# EAGLE design Z80_Control (EAGLE 5.11)
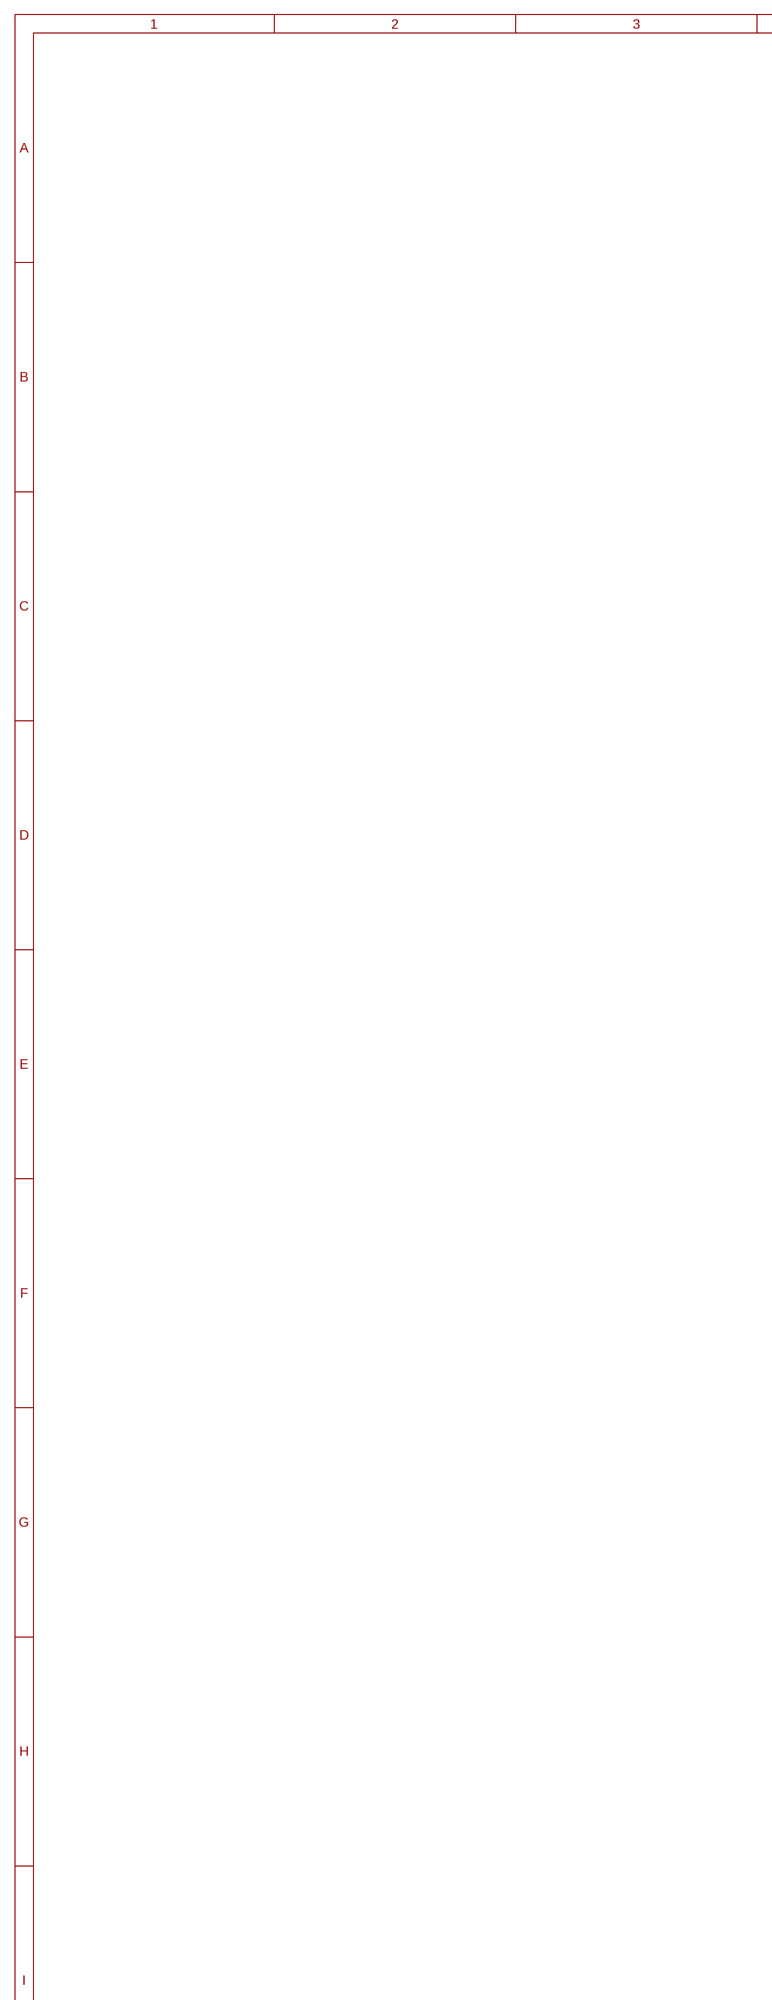
[diagram p0: schematic, sheet 1, part 1 of 2]
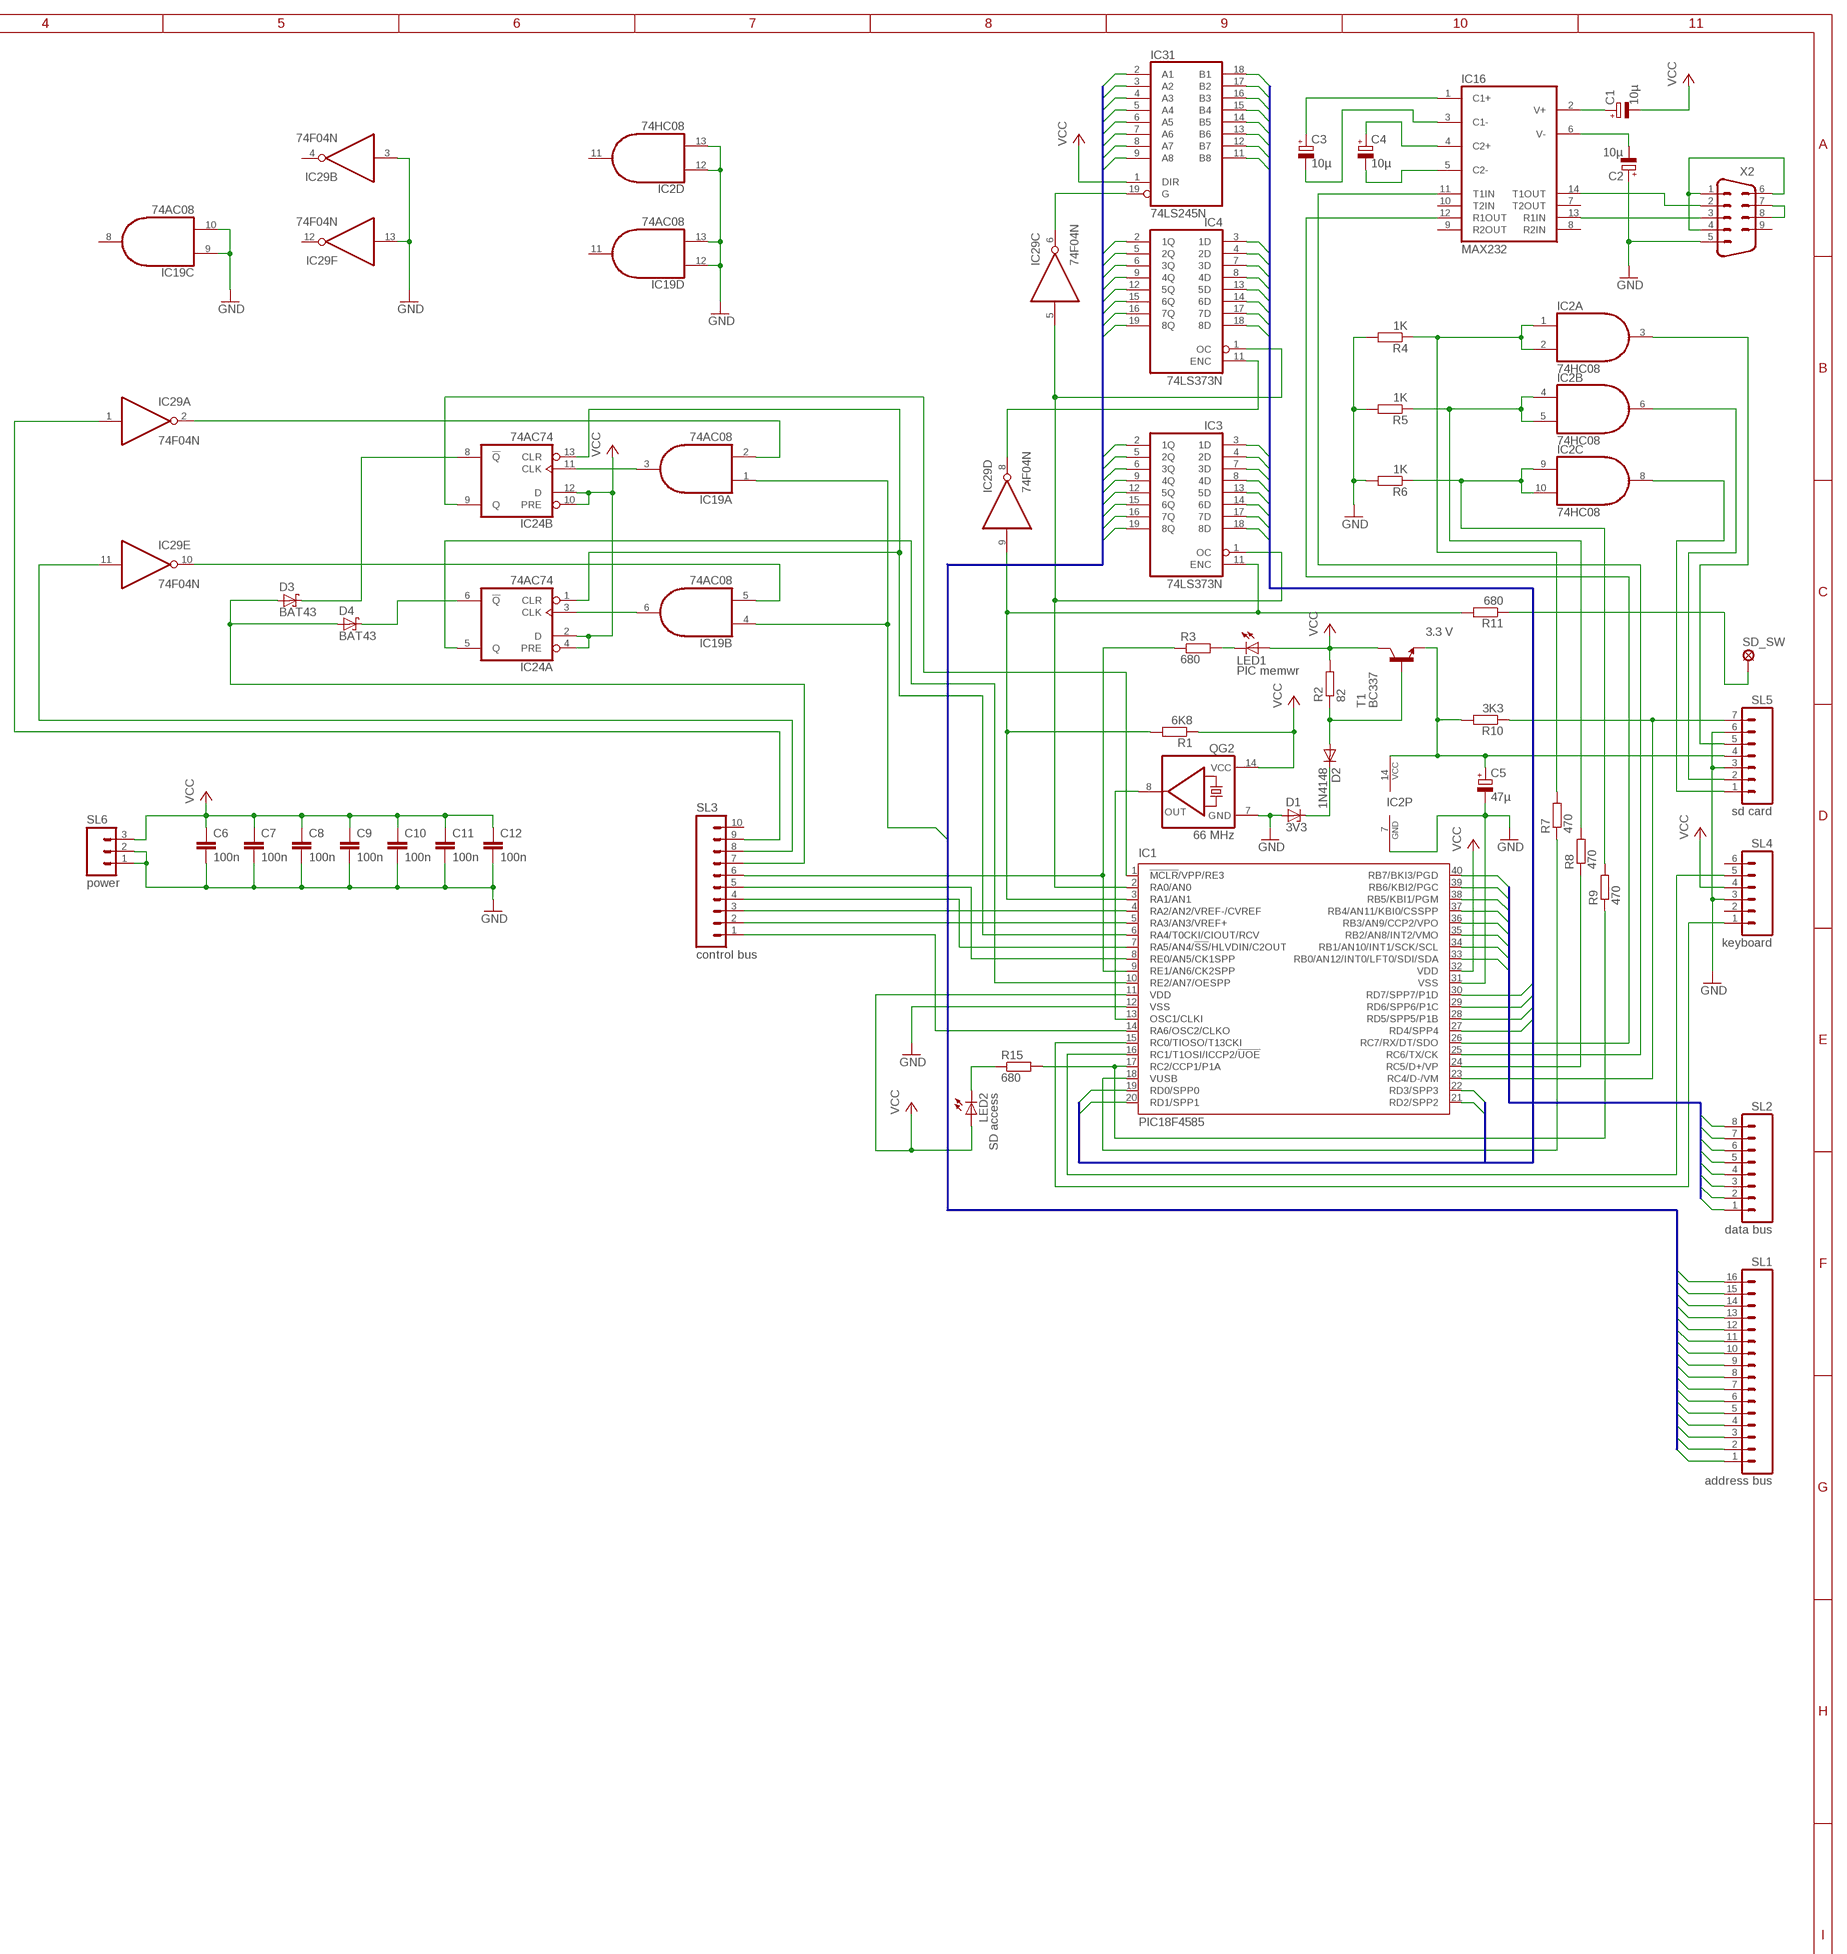
[diagram p1: schematic, sheet 1, part 2 of 2]

## Parts
C1  10µ  CPOL-EUE2.5-6  [E2,5-6]
C2  10µ  CPOL-EUE2.5-6  [E2,5-6]
C3  10µ  CPOL-EUE2.5-6  [E2,5-6]
C4  10µ  CPOL-EUE2.5-6  [E2,5-6]
C5  47µ  CPOL-EUE3.5-8  [E3,5-8]
C6  100n  C-EU050-030X075  [C050-030X075]
C7  100n  C-EU050-025X075  [C050-025X075]
C8  100n  C-EU050-030X075  [C050-030X075]
C9  100n  C-EU050-030X075  [C050-030X075]
C10  100n  C-EU050-030X075  [C050-030X075]
C11  100n  C-EU050-030X075  [C050-030X075]
C12  100n  C-EU050-030X075  [C050-030X075]
D1  3V3  BZX55  [DO35Z10]
D2  1N4148  1N4148DO35-7  [DO35-7]
D3  BAT43  BAT42  [DO35-10]
D4  BAT43  BAT42  [DO35-10]
IC1  PIC18F4585  PIC18F4455_40  [DIL40]
IC2  74HC08  74LS08N  [DIL14]
IC3  74LS373N  [DIL20]
IC4  74LS373N  [DIL20]
IC16  MAX232  [DIL16]
IC19  74AC08  74LS08N  [DIL14]
IC24  74AC74  74S74N  [DIL14]
IC29  74F04N  74AS04N  [DIL14]
IC31  74LS245N  [DIL20]
LED1  PIC memwr  LED5MM  [LED5MM]
LED2  SD access  LED5MM  [LED5MM]
QG2  66 MHz  QG5860  [DIL14S]
R1  6K8  R-EU_0207/10  [0207/10]
R2  82  R-EU_0207/10  [0207/10]
R3  680  R-EU_0207/10  [0207/10]
R4  1K  R-EU_0207/10  [0207/10]
R5  1K  R-EU_0207/10  [0207/10]
R6  1K  R-EU_0207/10  [0207/10]
R7  470  R-EU_0207/10  [0207/10]
R8  470  R-EU_0207/10  [0207/10]
R9  470  R-EU_0207/10  [0207/10]
R10  3K3  R-EU_0207/10  [0207/10]
R11  680  R-EU_0207/10  [0207/10]
R15  680  R-EU_0207/10  [0207/10]
SD_SW  LSP10  [LSP10]
SL1  address bus  M16  [16P]
SL2  data bus  M08  [08P]
SL3  control bus  M10  [10P]
SL4  keyboard  M06  [06P]
SL5  sd card  M07  [07P]
SL6  power  M03  [03P]
T1  BC337  BC337-40-NPN-TO92-EBC  [TO92-EBC]
X2  M09HP  [M09HP]

## Nets
/ADDR_WR: IC1.2(RA0/AN0) IC3.1(OC) IC4.1(OC) IC29.5(C:I)
/BUSRQ: IC1.4(RA2/AN2/VREF-/CVREF) SL3.3
/CLR_WAIT: IC1.6(RA4/T0CKI/CIOUT/RCV) IC24.1(A:CLR) IC24.13(B:CLR)
/INT: IC1.7(RA5/AN4/!SS!/HLVDIN/C2OUT) SL3.4
/IORD: IC29.1(A:I) SL3.9
/IOWR: IC29.11(E:I) SL3.8
/MEMRD_PIC: IC1.8(RE0/AN5/CK1SPP) SL3.5
/MEMWR_PIC: IC1.9(RE1/AN6/CK2SPP) R3.1 SL3.6
/RESET: IC1.14(RA6/OSC2/CLKO) SL3.1
/SD_CS: IC1.17(RC2/CCP1/P1A) R9.1 R15.2
/SD_CS3: IC2.9(C:I0) IC2.10(C:I1) R6.1 R9.2
/SD_CS3_B: IC2.8(C:O) SL5.1
/WAIT1: D4.C IC24.6(A:!Q)
/WAIT2: D3.C IC24.8(B:!Q)
/WAIT_1_2: D3.A D4.A SL3.7
AB0: IC4.2(1Q) IC31.2(A1) SL1.1
AB1: IC4.5(2Q) IC31.3(A2) SL1.2
AB2: IC4.6(3Q) IC31.4(A3) SL1.3
AB3: IC4.9(4Q) IC31.5(A4) SL1.4
AB4: IC4.12(5Q) IC31.6(A5) SL1.5
AB5: IC4.15(6Q) IC31.7(A6) SL1.6
AB6: IC4.16(7Q) IC31.8(A7) SL1.7
AB7: IC4.19(8Q) IC19.1(A:I0) IC19.4(B:I0) IC31.9(A8) SL1.8
AB8: IC3.2(1Q) SL1.9
AB9: IC3.5(2Q) SL1.10
AB10: IC3.6(3Q) SL1.11
AB11: IC3.9(4Q) SL1.12
AB12: IC3.12(5Q) SL1.13
AB13: IC3.15(6Q) SL1.14
AB14: IC3.16(7Q) SL1.15
AB15: IC3.19(8Q) SL1.16
ADDR_WR: IC29.6(C:O) IC31.19(G)
BUSAK_RESET: IC1.5(RA3/AN3/VREF+) SL3.2
CLK_PIC: IC1.13(OSC1/CLKI) QG2.8(OUT)
CTRL_RD: IC1.1(!MCLR!/VPP/RE3) IC24.9(B:Q)
CTRL_WR: IC1.10(RE2/AN7/OESPP) IC24.5(A:Q)
DB0: IC1.33(RB0/AN12/INT0/LFT0/SDI/SDA) SL2.1
DB1: IC1.34(RB1/AN10/INT1/SCK/SCL) SL2.2
DB2: IC1.35(RB2/AN8/INT2/VMO) SL2.3
DB3: IC1.36(RB3/AN9/CCP2/VPO) SL2.4
DB4: IC1.37(RB4/AN11/KBI0/CSSPP) SL2.5
DB5: IC1.38(RB5/KBI1/PGM) SL2.6
DB6: IC1.39(RB6/KBI2/PGC) SL2.7
DB7: IC1.40(RB7/BKI3/PGD) SL2.8
GND: C2.+ C5.- C6.2 C7.2 C8.2 C9.2 C10.2 C11.2 C12.2 D1.A IC1.12(VSS) IC1.31(VSS) IC2.7(P:GND) IC2.12(D:I0) IC2.13(D:I1) IC19.9(C:I0) IC19.10(C:I1) IC19.12(D:I0) IC19.13(D:I1) IC29.3(B:I) IC29.13(F:I) QG2.7(GND) R4.2 R5.2 R6.2 SL4.3 SL5.3 SL5.6 SL6.1 SL6.2 X2.5
IORD: IC19.2(A:I1) IC29.2(A:O)
IOWR: IC19.5(B:I1) IC29.10(E:O)
IOWR_PIC: IC19.6(B:O) IC24.3(A:CLK)
IOWR_PIC1: IC19.3(A:O) IC24.11(B:CLK)
KEYB_CLOCK: IC1.16(RC1/T1OSI/ICCP2/!UOE) SL4.5
KEYB_DATA: IC1.15(RC0/TIOSO/T13CKI) SL4.1
LD_HI_ADDR: IC1.3(RA1/AN1) IC3.11(ENC) IC29.9(D:I) R1.2 R11.2
LD_LO_ADDR: IC4.11(ENC) IC29.8(D:O)
N$1: R11.1 SD_SW.MP
N$2: D1.C D2.C
N$5: D2.A R2.1 T1.B
N$7: LED1.K(C) R3.2
N$9: LED2.K(C) R15.1
N$10: C4.- IC16.5(C2-)
N$32: C4.+ IC16.4(C2+)
N$34: C3.- IC16.3(C1-)
N$35: C3.+ IC16.1(C1+)
N$36: C2.- IC16.6(V-)
N$37: C1.+ IC16.2(V+)
N$40: X2.1 X2.4 X2.6
N$42: X2.7 X2.8
PA0: IC1.19(RD0/SPP0) IC3.3(1D) IC4.3(1D) IC31.18(B1)
PA1: IC1.20(RD1/SPP1) IC3.4(2D) IC4.4(2D) IC31.17(B2)
PA2: IC1.21(RD2/SPP2) IC3.7(3D) IC4.7(3D) IC31.16(B3)
PA3: IC1.22(RD3/SPP3) IC3.8(4D) IC4.8(4D) IC31.15(B4)
PA4: IC1.27(RD4/SPP4) IC3.13(5D) IC4.13(5D) IC31.14(B5)
PA5: IC1.28(RD5/SPP5/P1B) IC3.14(6D) IC4.14(6D) IC31.13(B6)
PA6: IC1.29(RD6/SPP6/P1C) IC3.17(7D) IC4.17(7D) IC31.12(B7)
PA7: IC1.30(RD7/SPP7/P1D) IC3.18(8D) IC4.18(8D) IC31.11(B8)
RS232_RX: IC16.13(R1IN) X2.3
RS232_TX: IC16.14(T1OUT) X2.2
SD_SCK: IC1.18(VUSB) R7.1
SD_SCK3: IC2.1(A:I0) IC2.2(A:I1) R4.1 R7.2
SD_SCK3_B: IC2.3(A:O) SL5.5
SD_SDI: IC1.23(RC4/D-/VM) R10.1 SL5.7
SD_SDO: IC1.24(RC5/D+/VP) R8.1
SD_SDO3: IC2.4(B:I0) IC2.5(B:I1) R5.1 R8.2
SD_SDO3_B: IC2.6(B:O) SL5.2
USART_RX: IC1.26(RC7/RX/DT/SDO) IC16.12(R1OUT)
USART_TX: IC1.25(RC6/TX/CK) IC16.11(T1IN)
VCC: C1.- C6.1 C7.1 C8.1 C9.1 C10.1 C11.1 C12.1 IC1.11(VDD) IC1.32(VDD) IC24.2(A:D) IC24.4(A:PRE) IC24.10(B:PRE) IC24.12(B:D) IC31.1(DIR) LED1.A LED2.A QG2.14(VCC) R1.1 R2.2 SL4.4 SL6.3 T1.C
VCC3: C5.+ IC2.14(P:VCC) R10.2 SL5.4 T1.E
Unconnected: IC2.11(D:O) IC16.7(T2OUT) IC16.8(R2IN) IC16.9(R2OUT) IC16.10(T2IN) IC19.8(C:O) IC19.11(D:O) IC29.4(B:O) IC29.12(F:O) SL3.10 SL4.2 SL4.6 X2.9

## Buses
AB[0..15]
DB[0..7]
PA[0..7]

## Notes on the sheet
- 3.3 V

## Power pins joined to a net without a drawn wire
GND: IC3.10(GND) IC4.10(GND) IC16.15(GND) IC19.7(P:GND) IC24.7(P:GND) IC29.7(P:GND) IC31.10(GND)
VCC: IC3.20(VCC) IC4.20(VCC) IC16.16(VCC) IC19.14(P:VCC) IC24.14(P:VCC) IC29.14(P:VCC) IC31.20(VCC)

## Library data of the parts
C1-C5 = rcl:CPOL-EU: POLARIZED CAPACITOR, European symbol
C6-C12 = rcl:C-EU: CAPACITOR, European symbol
D1 = diode:BZX55: Z DIODE
D2 = diode:1N4148: DIODE high speed (Philips)
D3 D4 = diode:BAT42: DIODE barrier diode
IC1 = microchip:PIC18F4*_40: USB Microcontrollers with nanoWatt Technology High-Performance, Enhanced Flash, 28/40/44-Pin, Source: http://ww1.microchip.com/downloads/en/devicedoc/39632c.pdf
IC2 IC19 = 74xx-us:74*08: Quad 2-input AND gate
IC3 IC4 = 74xx-us:74*373: Octal D type transparent LATCH, edge triggered
IC16 = maxim:MAX232: RS232 TRANSEIVER
IC24 = 74xx-us:74*74: Dual D type positive edge triggered FLIP FLOP, preset and clear
IC29 = 74xx-us:74*04: Hex INVERTER
IC31 = 74xx-us:74*245: Octal BUS TRANSCEIVER, 3-state
LED1 LED2 = led:LED: LED OSRAM: - CHIPLED LG R971, LG N971, LY N971, LG Q971, LY Q971, LO R971, LY R971 LH N974, LH R974 LS Q976, LO Q976, LY Q976 LO Q996 - Hyper CHIPLED LW Q18S LB Q993, LB Q99A, LB R99A - SideLED LS A670, LO A670, LY A670, LG A670, LP A670 LB A673, LV A673, LT A673, LW A673 LH A674 LY A675 LS A676, LA A676, LO A676, LY A676, LW A676 LS A679, LY A679, LG A679 - Hyper Micro SIDELED® LS Y876, LA Y876, LO Y876, LY Y876 LT Y87S - SmartLED LW L88C, LW L88S LB L89C, LB L89S, LG L890 LS L89K, LO L89K, LY L89K LS L896, LA L896, LO L896, LY L896 - TOPLED LS T670, LO T670, LY T670, LG T670, LP T670 LSG T670, LSP T670, LSY T670, LOP T670, LYG T670 LG T671, LOG T671, LSG T671 LB T673, LV T673, LT T673, LW T673 LH T674 LS T676, LA T676, LO T676, LY T676, LB T676, LH T676, LSB T676, LW T676 LB T67C, LV T67C, LT T67C, LS T67K, LO T67K, LY T67K, LW E67C LS E67B, LA E67B, LO E67B, LY E67B, LB E67C, LV E67C, LT E67C LW T67C LS T679, LY T679, LG T679 LS T770, LO T770, LY T770, LG T770, LP T770 LB T773, LV T773, LT T773, LW T773 LH T774 LS E675, LA E675, LY E675, LS T675 LS T776, LA T776, LO T776, LY T776, LB T776 LHGB T686 LT T68C, LB T68C - Hyper Mini TOPLED® LB M676 - Mini TOPLED Santana® LG M470 LS M47K, LO M47K, LY M47K Source: http://www.osram.convergy.de LUXEON: - LUMILED® LXK2-PW12-R00, LXK2-PW12-S00, LXK2-PW14-U00, LXK2-PW14-V00 LXK2-PM12-R00, LXK2-PM12-S00, LXK2-PM14-U00 LXK2-PE12-Q00, LXK2-PE12-R00, LXK2-PE12-S00, LXK2-PE14-T00, LXK2-PE14-U00 LXK2-PB12-K00, LXK2-PB12-L00, LXK2-PB12-M00, LXK2-PB14-N00, LXK2-PB14-P00, LXK2-PB14-Q00 LXK2-PR12-L00, LXK2-PR12-M00, LXK2-PR14-Q00, LXK2-PR14-R00 LXK2-PD12-Q00, LXK2-PD12-R00, LXK2-PD12-S00 LXK2-PH12-R00, LXK2-PH12-S00 LXK2-PL12-P00, LXK2-PL12-Q00, LXK2-PL12-R00 Source: www.luxeon.com KINGBRIGHT: KA-3528ASYC Source: www.kingbright.com
QG2 = crystal:QG5860: CRYSTAL RESONATOR
R1-R11 R15 = rcl:R-EU_: RESISTOR, European symbol
SD_SW = solpad:LSP10: SOLDER PAD drill 1.0 mm, distributor Buerklin, 12H555
SL1 = con-amp-quick:M16: AMP QUICK CONNECTOR
SL2 = con-amp-quick:M08: AMP QUICK CONNECTOR
SL3 = con-amp-quick:M10: AMP QUICK CONNECTOR
SL4 = con-amp-quick:M06: AMP QUICK CONNECTOR
SL5 = con-amp-quick:M07: AMP QUICK CONNECTOR
SL6 = con-amp-quick:M03: AMP QUICK CONNECTOR
T1 = transistor:*-NPN-: NPN Transistror BF959 corrected 2008.03.06
X2 = con-subd:M09: SUB-D

## Board
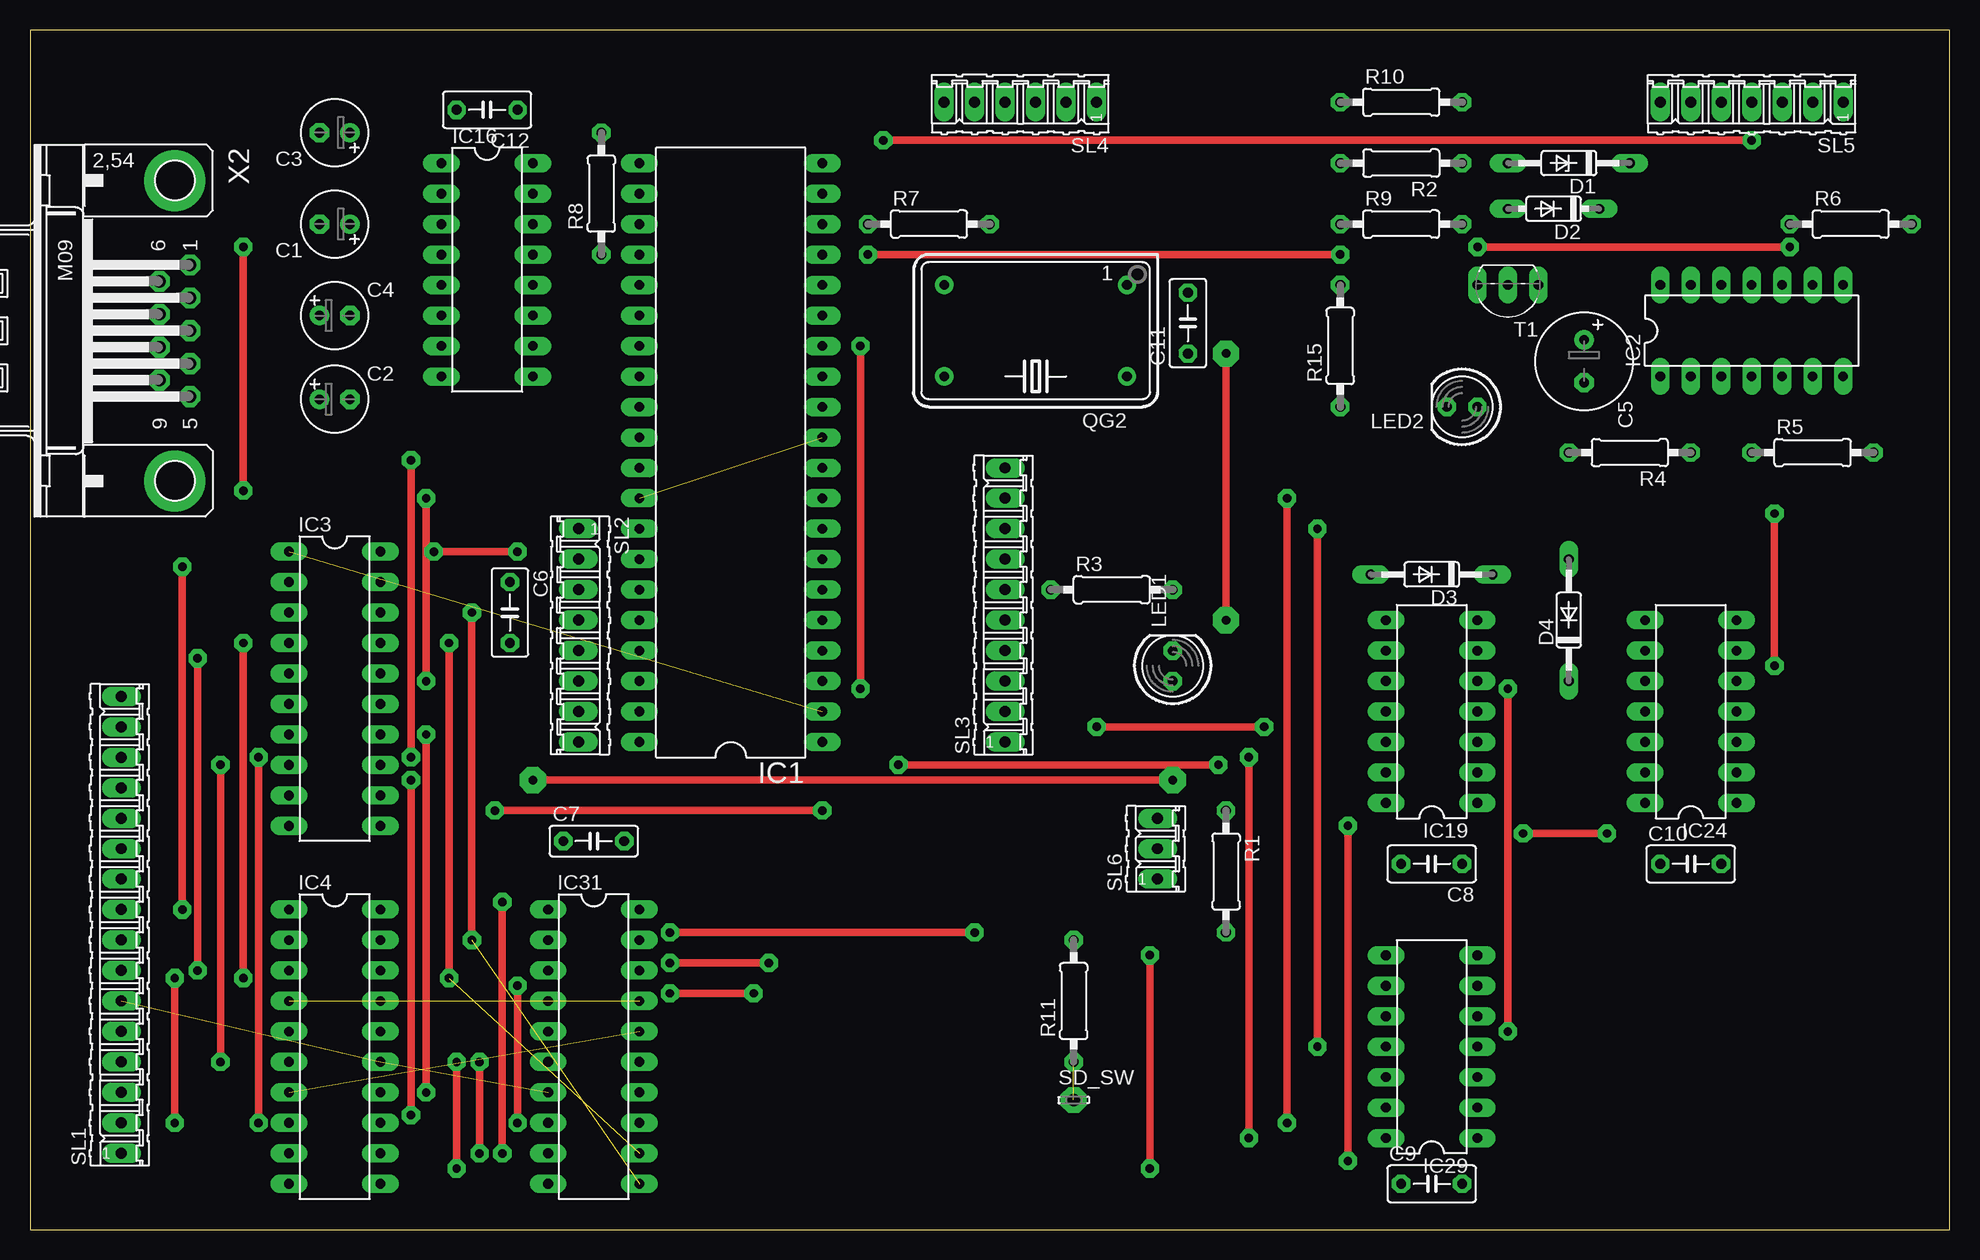
[diagram p2: board, top side]
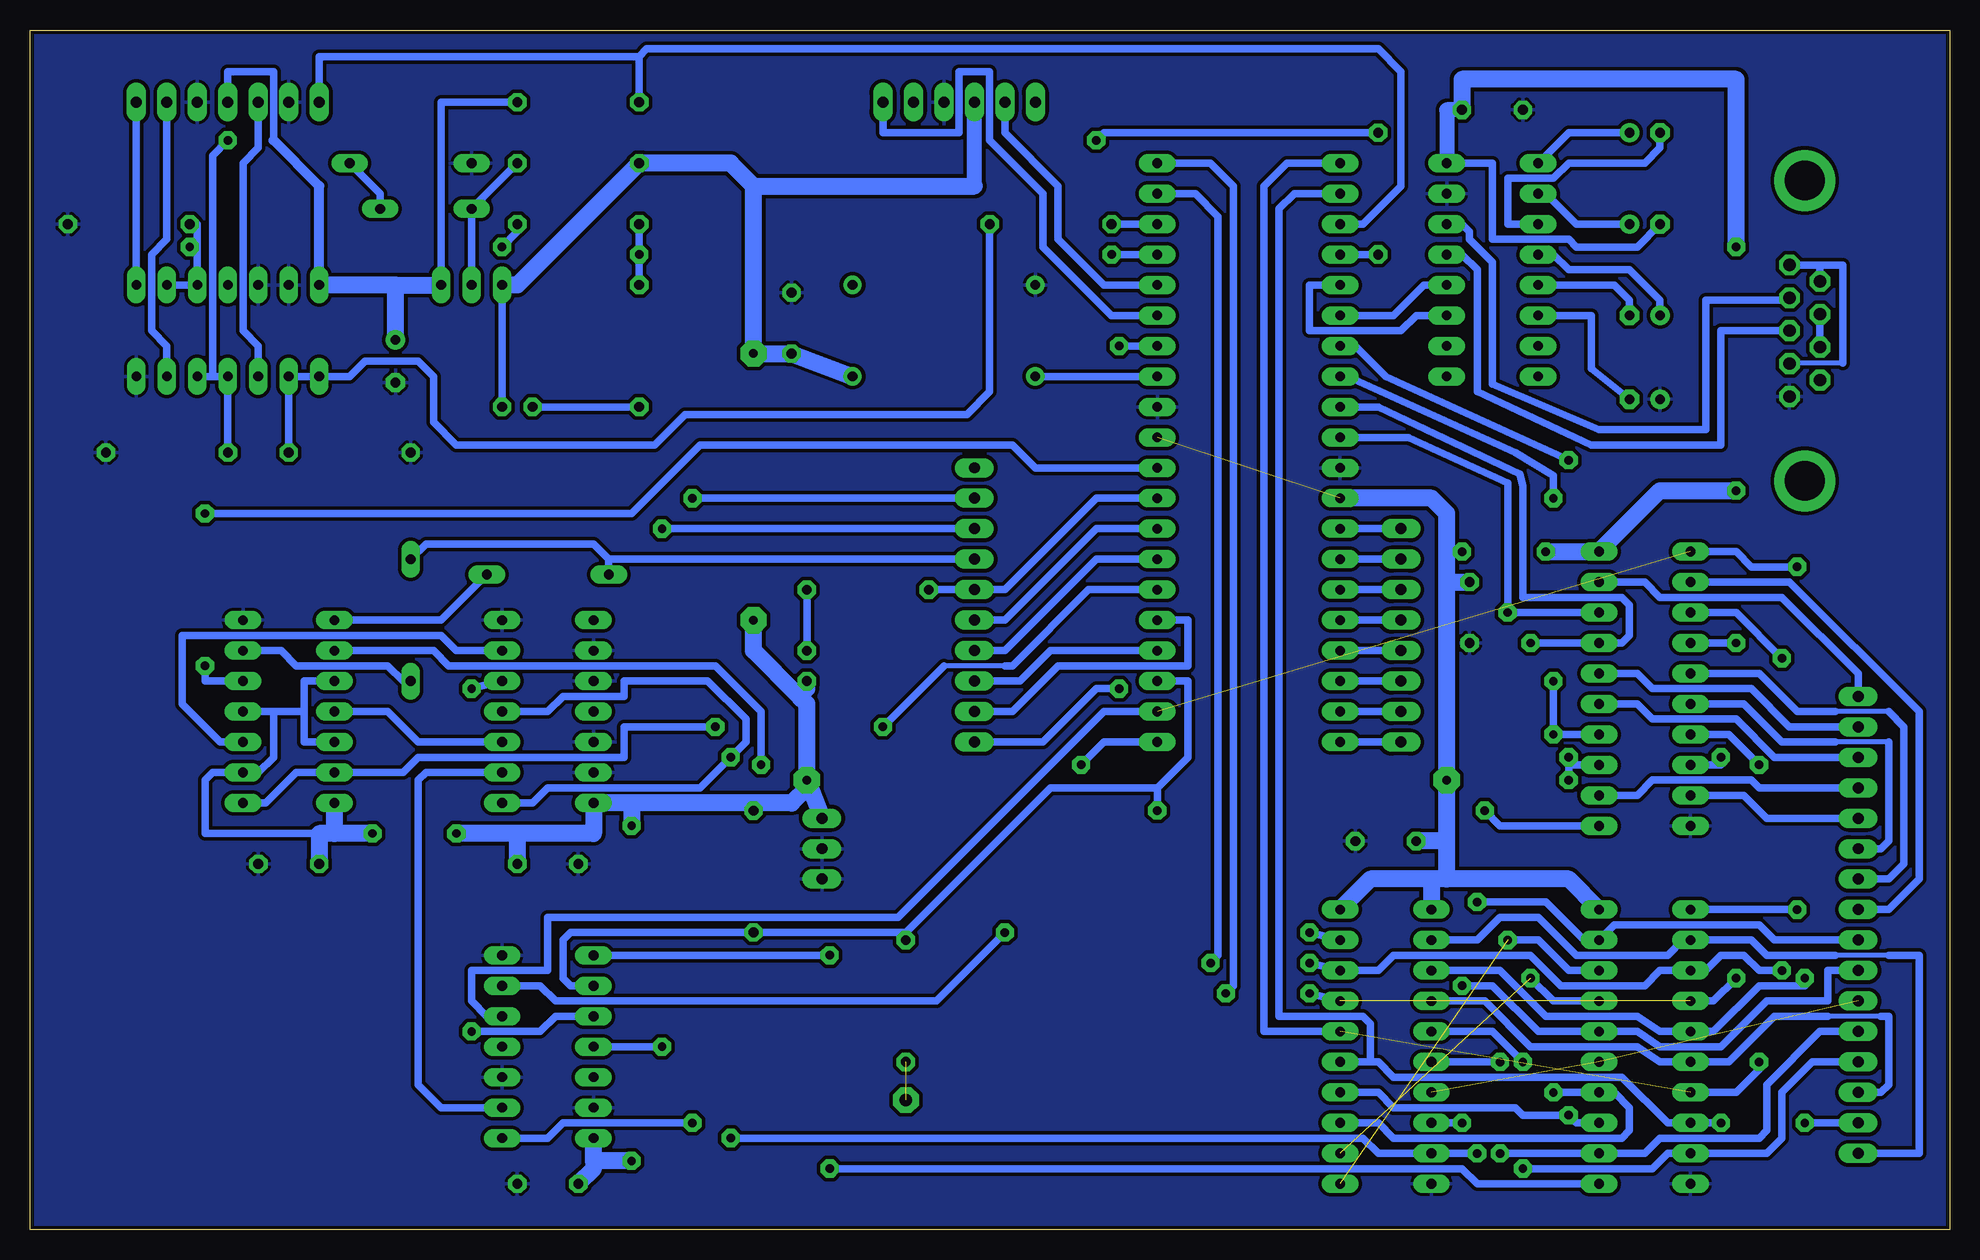
[diagram p3: board, bottom side, seen from below]

Size 160 x 100 mm. Coordinates in mm from the lower left corner, seen from the top.
Outline: 0,0 160,0 160,100 0,100 0,0
Copper layers (1*16): Top 0.035mm / dielectric 1.5mm / Bottom 0.035mm
Design rules "default *": minimum track width 14mil, minimum drill 24mil, track to track 12mil, track to pad 12mil, pad to pad 8mil, via to via 8mil, smd to smd 8mil, copper to edge 12mil, drill to drill 8mil, minimum pad ring 14mil, minimum via ring 16mil, stop-mask expansion 4mil, vias tented up to drill 0mil, thermal gap 10mil

### Footprints (pad centres in the part's own frame; a part is rotated, then mirrored left to right if it is on the bottom)
E2,5-6 = drill 0.813 pad 1.6 round: + -1.27,0 | drill 0.813 pad 1.6 octagon: - 1.27,0
E3,5-8 = drill 0.813 pad 1.6 round: + -1.778,0 | drill 0.813 pad 1.6 octagon: - 1.778,0
C050-030X075 = drill 0.813 octagon: 1 -2.54,0; 2 2.54,0
C050-025X075 = drill 0.813 octagon: 1 -2.54,0; 2 2.54,0
DO35Z10 = drill 0.813 long: A 5.08,0; C -5.08,0
DO35-7 = drill 0.813 long: A 3.81,0; C -3.81,0
DO35-10 = drill 0.813 long: A 5.08,0; C -5.08,0
DIL40 = drill 0.813 long: 1 -24.13,-7.62; 2 -21.59,-7.62; 3 -19.05,-7.62; 4 -16.51,-7.62; 5 -13.97,-7.62; 6 -11.43,-7.62; 7 -8.89,-7.62; 8 -6.35,-7.62; 9 -3.81,-7.62; 10 -1.27,-7.62; 11 1.27,-7.62; 12 3.81,-7.62; 13 6.35,-7.62; 14 8.89,-7.62; 15 11.43,-7.62; 16 13.97,-7.62; 17 16.51,-7.62; 18 19.05,-7.62; 19 21.59,-7.62; 20 24.13,-7.62; 21 24.13,7.62; 22 21.59,7.62; 23 19.05,7.62; 24 16.51,7.62; 25 13.97,7.62; 26 11.43,7.62; 27 8.89,7.62; 28 6.35,7.62; 29 3.81,7.62; 30 1.27,7.62; 31 -1.27,7.62; 32 -3.81,7.62; 33 -6.35,7.62; 34 -8.89,7.62; 35 -11.43,7.62; 36 -13.97,7.62; 37 -16.51,7.62; 38 -19.05,7.62; 39 -21.59,7.62; 40 -24.13,7.62
DIL14 = drill 0.813 long: 1 -7.62,-3.81; 2 -5.08,-3.81; 3 -2.54,-3.81; 4 0,-3.81; 5 2.54,-3.81; 6 5.08,-3.81; 7 7.62,-3.81; 8 7.62,3.81; 9 5.08,3.81; 10 2.54,3.81; 11 0,3.81; 12 -2.54,3.81; 13 -5.08,3.81; 14 -7.62,3.81
DIL20 = drill 0.813 long: 1 -11.43,-3.81; 2 -8.89,-3.81; 3 -6.35,-3.81; 4 -3.81,-3.81; 5 -1.27,-3.81; 6 1.27,-3.81; 7 3.81,-3.81; 8 6.35,-3.81; 9 8.89,-3.81; 10 11.43,-3.81; 11 11.43,3.81; 12 8.89,3.81; 13 6.35,3.81; 14 3.81,3.81; 15 1.27,3.81; 16 -1.27,3.81; 17 -3.81,3.81; 18 -6.35,3.81; 19 -8.89,3.81; 20 -11.43,3.81
DIL16 = drill 0.813 long: 1 -8.89,-3.81; 2 -6.35,-3.81; 3 -3.81,-3.81; 4 -1.27,-3.81; 5 1.27,-3.81; 6 3.81,-3.81; 7 6.35,-3.81; 8 8.89,-3.81; 9 8.89,3.81; 10 6.35,3.81; 11 3.81,3.81; 12 1.27,3.81; 13 -1.27,3.81; 14 -3.81,3.81; 15 -6.35,3.81; 16 -8.89,3.81
LED5MM = drill 0.813 octagon: A -1.27,0; K 1.27,0
DIL14S = drill 0.813 round: 1 -7.62,-3.81; 7 7.62,-3.81; 8 7.62,3.81; 14 -7.62,3.81
0207/10 = drill 0.813 octagon: 1 -5.08,0; 2 5.08,0
LSP10 = drill 1.016 pad 2.159 octagon: MP 0,0
16P = drill 0.914 long: 1 -19.05,0; 2 -16.51,0; 3 -13.97,0; 4 -11.43,0; 5 -8.89,0; 6 -6.35,0; 7 -3.81,0; 8 -1.27,0; 9 1.27,0; 10 3.81,0; 11 6.35,0; 12 8.89,0; 13 11.43,0; 14 13.97,0; 15 16.51,0; 16 19.05,0
08P = drill 0.914 long: 1 -8.89,0; 2 -6.35,0; 3 -3.81,0; 4 -1.27,0; 5 1.27,0; 6 3.81,0; 7 6.35,0; 8 8.89,0
10P = drill 0.914 long: 1 -11.43,0; 2 -8.89,0; 3 -6.35,0; 4 -3.81,0; 5 -1.27,0; 6 1.27,0; 7 3.81,0; 8 6.35,0; 9 8.89,0; 10 11.43,0
06P = drill 0.914 long: 1 -6.35,0; 2 -3.81,0; 3 -1.27,0; 4 1.27,0; 5 3.81,0; 6 6.35,0
07P = drill 0.914 long: 1 -7.62,0; 2 -5.08,0; 3 -2.54,0; 4 0,0; 5 2.54,0; 6 5.08,0; 7 7.62,0
03P = drill 0.914 long: 1 -2.54,0; 2 0,0; 3 2.54,0
TO92-EBC = drill 0.813 long: B 0,-1.27; C 2.54,-1.27; E -2.54,-1.27
M09HP = drill 1.016 octagon: 1 -5.486,1.27; 2 -2.743,1.27; 3 0,1.27; 4 2.743,1.27; 5 5.486,1.27; 6 -4.115,-1.27; 7 -1.372,-1.27; 8 1.372,-1.27; 9 4.115,-1.27 | drill 3.302 pad 5.08 round: G1 -12.522,0; G2 12.522,0

### Placement (x,y rotation side)
C1  25.4,83.82 180 top
C2  25.4,69.22 0 top
C3  25.4,91.44 180 top
C4  25.4,76.2 0 top
C5  129.54,72.39 270 top
C6  40.01,51.44 270 top
C7  46.99,32.38 0 top
C8  116.84,30.48 180 top
C9  116.84,3.81 0 top
C10  138.43,30.48 0 top
C11  96.52,75.56 90 top
C12  38.1,93.34 180 top
D1  128.27,88.9 180 top
D2  127,85.09 180 top
D3  116.84,54.61 180 top
D4  128.27,50.8 90 top
IC1  58.42,64.77 90 top
IC2  143.51,74.93 0 top
IC3  25.4,45.09 270 top
IC4  25.4,15.24 270 top
IC16  38.1,80.01 270 top
IC19  116.84,43.18 90 top
IC24  138.43,43.18 90 top
IC29  116.84,15.24 90 top
IC31  46.99,15.24 270 top
LED1  95.25,46.99 90 top
LED2  119.38,68.58 180 top
QG2  83.82,74.93 180 top
R1  99.69,29.84 270 top
R2  114.3,88.9 180 top
R3  90.17,53.34 0 top
R4  133.35,64.77 180 top
R5  148.59,64.77 0 top
R6  151.76,83.82 0 top
R7  74.93,83.82 0 top
R8  47.62,86.36 90 top
R9  114.3,83.82 0 top
R10  114.3,93.98 0 top
R11  87,19.05 90 top
R15  109.22,73.66 90 top
SD_SW  87,10.79 0 top
SL1  7.62,25.4 90 top
SL2  45.72,49.53 270 top
SL3  81.28,52.07 90 top
SL4  82.55,93.98 180 top
SL5  143.51,93.98 180 top
SL6  93.98,31.75 90 top
T1  123.19,77.47 180 top
X2  12.06,74.93 270 top

### Tracks (layer width: path | path; a pad name or v marks a point on that pad's centre or on a via)
/ADDR_WR  (via drill 0.7)  (1 unrouted)
  Top 0.61: v12.7,26.67 v12.7,55.24
  Bottom 0.61: IC1.2 70.48,43.18 87.63,26.04 116.84,26.04 116.84,21.59 123.19,21.59 123.19,19.05 121.92,17.78 IC29.5 | v12.7,26.67 IC4.1 | v12.7,55.24 16.51,55.24 17.78,56.52 IC3.1
/BUSRQ
  Bottom 0.61: IC1.4 74.93,48.26 77.47,45.72 SL3.3
/CLR_WAIT  (via drill 0.7)
  Top 0.61: v88.9,41.91 v102.87,41.91
  Bottom 0.406: 78.74,46.99 83.82,46.99
  Bottom 0.61: IC24.1 140.34,35.56 137.79,38.1 IC24.13 128.91,38.1 127.64,39.37 110.49,39.37 110.49,41.91 v102.87,41.91 | 83.82,46.99 v88.9,41.91 | 78.74,46.99 78.11,46.99 71.75,53.34 IC1.6
/INT
  Bottom 0.61: SL3.4 78.74,48.26 71.12,55.88 IC1.7
/IORD  (via drill 0.7)
  Top 0.61: v104.78,8.89 v104.78,60.96
  Bottom 0.61: v104.78,60.96 SL3.9 | v104.78,8.89 115.57,8.89 116.84,7.62 IC29.1
/IOWR  (via drill 0.7)
  Top 0.61: v107.31,15.24 v107.31,58.42
  Bottom 0.61: v107.31,58.42 SL3.8 | v107.31,15.24 IC29.11
/MEMRD_PIC
  Bottom 0.61: SL3.5 78.74,50.8 71.12,58.42 IC1.8
/MEMWR_PIC
  Bottom 0.61: IC1.9 71.12,60.96 78.74,53.34 SL3.6 R3.1
/RESET  (via drill 0.7)
  Top 0.61: v69.22,45.09 v69.22,73.66
  Bottom 0.61: SL3.1 75.56,40.64 71.12,45.09 v69.22,45.09 | v69.22,73.66 IC1.14
/SD_CS  (via drill 0.7)
  Top 0.61: v69.85,81.28 v109.22,81.28
  Bottom 0.61: R15.2 v109.22,81.28 R9.1 | IC1.17 v69.85,81.28
/SD_CS3  (via drill 0.7)
  Top 0.61: v120.65,81.92 v146.69,81.92
  Bottom 0.61: IC2.9 IC2.10 146.05,81.92 | R9.2 119.38,83.19 v120.65,81.92 | v146.69,81.92 146.05,81.92 | 146.05,81.92 146.05,83.82 R6.1
/SD_CS3_B
  Bottom 0.61: IC2.8 SL5.1
/WAIT1
  Bottom 0.61: D4.C 128.91,45.72 130.18,46.99 137.79,46.99 139.06,48.26 IC24.6
/WAIT2
  Bottom 0.61: IC24.8 125.73,50.8 D3.C
/WAIT_1_2
  Bottom 0.61: SL3.7 111.76,55.88 | 111.76,55.88 D3.A | 111.76,55.88 113.03,57.15 127,57.15 D4.A
AB0
  Bottom 0.406: 5.08,22.86 9.53,22.86
  Bottom 0.61: 9.53,22.86 15.24,22.86 16.51,24.13 IC4.2 22.23,24.13 23.5,22.86 31.11,22.86 34.29,26.04 37.47,26.04 39.37,24.13 IC31.2 | 5.08,22.86 2.54,22.86 2.54,6.35 SL1.1
AB1  (via drill 0.7)
  Top 0.61: v12.06,8.89 12.06,20.32 v12.06,20.95
  Bottom 0.61: IC31.3 37.47,21.59 33.66,17.78 26.04,17.78 24.13,16.51 IC4.5 19.68,16.51 15.88,20.32 12.06,20.32 v12.06,20.95 | SL1.2 v12.06,8.89
AB2
  Bottom 0.406: 5.71,17.78 10.16,17.78
  Bottom 0.61: IC31.4 38.73,19.05 34.92,15.24 26.04,15.24 24.13,13.97 IC4.6 18.41,13.97 14.61,17.78 10.16,17.78 | SL1.3 5.71,11.43 5.08,12.06 5.08,17.78 5.71,17.78
AB3  (via drill 0.7)
  Top 0.61: v35.56,5.08 v35.56,13.97
  Bottom 0.61: SL1.4 11.43,13.97 13.97,11.43 13.97,7.62 15.24,6.35 IC4.9 23.5,6.35 24.77,5.08 v35.56,5.08 | IC31.5 38.1,16.51 v35.56,13.97
AB4  (via drill 0.7)
  Top 0.61: v37.47,6.35 v37.47,13.97
  Bottom 0.61: SL1.5 10.79,16.51 15.24,12.06 15.24,8.26 15.88,7.62 24.13,7.62 25.4,6.35 IC4.12 v37.47,6.35 | v37.47,13.97 IC31.6
AB5  (2 unrouted)
AB6  (via drill 0.7)
  Top 0.61: v40.64,20.32 v40.64,8.89
  Bottom 0.61: SL1.7 10.16,21.59 10.16,19.05 15.24,19.05 19.05,15.24 24.13,15.24 26.04,16.51 IC4.16 34.29,16.51 38.1,20.32 v40.64,20.32 | v40.64,8.89 IC31.8
AB7  (via drill 0.7)
  Top 0.61: v39.37,27.3 v39.37,6.35 | v101.6,7.62 v101.6,39.37
  Bottom 0.61: SL1.8 14.61,24.13 15.88,25.4 27.94,25.4 IC4.19 30.48,24.13 33.66,27.3 v39.37,27.3 | v39.37,6.35 IC31.9 47.62,6.35 48.9,7.62 v101.6,7.62 | IC19.1 118.11,35.56 116.84,36.83 104.14,36.83 v101.6,39.37 100.33,40.64 100.33,42.55 103.5,45.72 110.49,45.72 110.49,44.45 115.57,44.45 116.84,43.18 IC19.4
AB8
  Bottom 0.61: SL1.9 5.08,26.67 2.54,29.21 2.54,43.18 13.34,53.98 IC3.2
AB9
  Bottom 0.406: 5.08,43.18 9.53,43.18
  Bottom 0.61: IC3.5 15.88,46.35 12.7,43.18 9.53,43.18 | 5.08,43.18 3.81,41.91 3.81,30.48 5.08,29.21 SL1.10
AB10
  Bottom 0.406: 5.08,40.64 9.53,40.64
  Bottom 0.61: IC3.6 17.14,43.81 13.97,40.64 9.53,40.64 | 5.08,40.64 5.08,32.38 5.71,31.75 SL1.11
AB11
  Bottom 0.61: SL1.12 15.24,34.29 17.14,36.2 IC3.9
AB12
  Bottom 0.61: SL1.13 15.88,36.83 16.51,37.47 24.77,37.47 26.04,36.2 IC3.12
AB13
  Bottom 0.61: SL1.14 14.61,39.37 17.78,42.55 24.77,42.55 26.04,43.81 IC3.15
AB14
  Bottom 0.61: IC3.16 26.04,46.35 24.77,45.09 16.51,45.09 13.34,41.91 SL1.15
AB15
  Bottom 0.61: IC3.19 25.4,53.98 24.13,52.7 13.97,52.7 7.62,46.35 SL1.16
ADDR_WR  (via drill 0.7)
  Top 0.61: v53.34,24.77 v78.74,24.77
  Bottom 0.61: IC29.6 117.47,20.32 116.2,19.05 84.45,19.05 v78.74,24.77 | IC31.19 v53.34,24.77
BUSAK_RESET
  Bottom 0.61: SL3.2 78.11,43.18 74.3,46.99 63.5,46.99 63.5,50.8 IC1.5
CLK_PIC
  Bottom 0.61: IC1.13 QG2.8
CTRL_RD  (via drill 0.7)
  Top 0.61: v72.39,38.73 v99.06,38.73
  Bottom 0.61: IC1.1 70.48,40.64 v72.39,38.73 | v99.06,38.73 99.06,43.18 102.87,46.99 125.09,46.99 126.36,48.26 IC24.9
CTRL_WR  (via drill 0.7)
  Top 0.61: v145.41,59.69 v145.41,46.99
  Bottom 0.61: IC1.10 76.2,63.5 78.11,65.41 104.14,65.41 109.86,59.69 v145.41,59.69 | v145.41,46.99 145.41,45.72 IC24.5
DB0
  Bottom 0.61: SL2.1 IC1.33
DB1
  Bottom 0.61: SL2.2 IC1.34
DB2
  Bottom 0.61: SL2.3 IC1.35
DB3
  Bottom 0.61: SL2.4 IC1.36
DB4
  Bottom 0.61: SL2.5 IC1.37
DB5
  Bottom 0.61: SL2.6 IC1.38
DB6
  Bottom 0.61: SL2.7 IC1.39
DB7
  Bottom 0.61: SL2.8 IC1.40
GND
  pour Bottom: 0,99.69 0,0.64 0.64,0 160.66,0 160.66,100.33 0.64,100.33
IORD
  Bottom 0.61: IC29.2 125.73,10.16 127.64,12.06 127.64,37.47 127,38.1 IC19.2
IOWR  (via drill 0.7)
  Top 0.61: v123.19,16.51 v123.19,45.09
  Bottom 0.61: IC29.10 116.2,17.78 117.47,16.51 v123.19,16.51 | v123.19,45.09 IC19.5
IOWR_PIC
  Bottom 0.61: IC19.6 124.46,48.26 125.73,49.53 147.32,49.53 147.32,43.81 144.15,40.64 IC24.3
IOWR_PIC1
  Bottom 0.61: IC19.3 127.64,40.64 130.18,43.18 IC24.11
KEYB_CLOCK
  Bottom 0.61: IC1.16 70.48,78.74 74.3,82.55 74.3,87 78.74,91.44 SL4.5
KEYB_DATA
  Bottom 0.61: IC1.15 69.85,76.2 75.56,81.92 75.56,86.36 80.01,90.81 80.01,96.52 82.55,96.52 82.55,91.44 88.9,91.44 SL4.1
LD_HI_ADDR  (via drill 0.7)
  Top 0.61: v38.73,34.92 v66.04,34.92
  Bottom 0.61: IC1.3 63.5,45.72 63.5,39.37 66.04,36.83 | 87,24.77 74.93,36.83 66.04,36.83 | IC29.9 114.94,20.32 115.57,20.95 115.57,24.13 114.94,24.77 R1.2 87,24.77 | IC3.11 37.47,33.66 v38.73,34.92 | v66.04,34.92 66.04,36.83 | 87,24.77 R11.2
LD_LO_ADDR  (via drill 0.7)
  Top 0.61: v93.34,5.08 v93.34,22.86
  Bottom 0.61: IC4.11 39.37,3.81 40.64,5.08 v93.34,5.08 | v93.34,22.86 IC29.8
N$1  (1 unrouted)
N$2
  Bottom 0.61: D2.C 130.81,86.36 D1.C
N$5
  Bottom 0.61: T1.B D2.A R2.1
N$7
  Bottom 0.61: LED1.K R3.2
N$9
  Bottom 0.61: R15.1 LED2.K
N$10
  Bottom 0.61: IC16.5 27.94,78.74 26.67,77.47 C4.-
N$32
  Bottom 0.61: C4.+ 24.13,77.47 26.67,80.01 31.75,80.01 33.02,81.28 IC16.4
N$34
  Bottom 0.61: C3.- 24.13,90.17 25.4,88.9 31.75,88.9 33.02,87.63 36.83,87.63 36.83,83.82 IC16.3
N$35
  Bottom 0.61: C3.+ 31.75,91.44 IC16.1
N$36
  Bottom 0.61: IC16.6 29.84,76.2 29.84,71.75 C2.-
N$37
  Bottom 0.61: IC16.2 33.66,86.36 31.11,83.82 C1.+
N$40
  Bottom 0.406: X2.4 13.34,72.23 8.89,72.23
  Bottom 0.61: 10.79,80.42 X2.6 | 10.79,80.42 X2.1 | 8.89,72.23 8.89,80.42 10.79,80.42
N$42
  Bottom 0.61: X2.8 X2.7
PA0  (via drill 0.7)
  Top 0.61: v13.97,21.59 v13.97,47.62 | v53.34,22.23 v61.59,22.23
  Bottom 0.61: IC1.19 62.87,86.36 60.96,84.45 60.96,22.86 v61.59,22.23 | v13.97,21.59 15.88,21.59 17.14,22.86 19.05,22.86 20.32,21.59 IC4.3 24.13,21.59 25.4,20.32 32.38,20.32 34.92,22.86 46.35,22.86 47.62,21.59 IC31.18 v53.34,22.23 | v13.97,47.62 17.78,51.44 IC3.3
PA1  (via drill 0.7)  (1 unrouted)
  Top 0.61: v17.78,20.95 v17.78,48.9 | v53.34,19.68 v60.33,19.68
  Bottom 0.61: IC1.20 61.59,88.9 59.69,87 59.69,20.32 v60.33,19.68 | IC4.4 19.68,19.05 v17.78,20.95 | v17.78,48.9 IC3.4 | IC31.17 v53.34,19.68
PA2  (via drill 0.7)  (1 unrouted)
  Top 0.61: v15.88,13.97 v15.88,38.73
  Bottom 0.61: IC1.21 55.24,88.9 57.15,87 57.15,16.51 IC31.16 | IC3.7 18.41,41.27 v15.88,38.73 | v15.88,13.97 15.88,13.34 17.78,11.43 IC4.7
PA3  (via drill 0.7)
  Top 0.61: v19.05,8.89 v19.05,39.37
  Bottom 0.61: IC1.22 54.61,86.36 55.88,85.09 55.88,17.78 48.9,17.78 48.26,17.14 48.26,13.97 | v19.05,8.89 IC4.8 23.5,8.89 27.3,12.7 46.35,12.7 47.62,13.97 48.26,13.97 | v19.05,39.37 19.05,38.73 IC3.8 | 48.26,13.97 IC31.15
PA4  (via drill 0.7)
  Top 0.61: v31.75,9.53 v31.75,37.47 | v31.75,39.37 v31.75,64.14
  Bottom 0.61: IC1.27 49.53,73.66 46.99,71.12 v31.75,64.14 | IC31.14 47.62,11.43 46.35,10.16 37.47,10.16 36.2,10.16 35.56,9.53 v31.75,9.53 31.11,8.89 IC4.13 | IC3.13 31.75,38.73 v31.75,37.47 v31.75,39.37
PA5  (via drill 0.7)
  Top 0.61: v33.02,11.43 v33.02,41.27 | v33.02,45.72 v33.02,60.96
  Bottom 0.61: IC1.28 50.16,71.12 36.2,64.77 33.02,62.87 v33.02,60.96 | IC31.13 47.62,8.89 46.35,7.62 27.3,7.62 26.67,8.26 26.67,10.16 27.94,11.43 IC4.14 v33.02,11.43 | IC3.14 v33.02,41.27 v33.02,45.72
PA6  (via drill 0.7)  (1 unrouted)
  Top 0.61: v34.92,20.95 v34.92,48.9
  Bottom 0.61: IC1.29 47.62,68.58 35.81,62.99 35.56,61.98 35.56,52.7 27.3,52.7 26.67,52.07 26.67,49.53 27.3,48.9 IC3.17 v34.92,48.9 | IC4.17 33.02,19.05 v34.92,20.95
PA7  (via drill 0.7)  (1 unrouted)
  Top 0.61: v36.83,24.13 v36.83,51.44
  Bottom 0.61: IC1.30 45.09,66.04 36.83,62.23 v36.83,51.44 IC3.18 | IC4.18 31.75,21.59 34.29,24.13 v36.83,24.13
RS232_RX
  Bottom 0.61: X2.3 19.05,74.93 19.05,65.41 29.84,65.41 39.37,69.85 39.37,80.01 40.64,81.28 IC16.13
RS232_TX
  Bottom 0.61: IC16.14 40.64,83.82 40.01,83.19 40.01,82.55 38.1,80.64 38.1,70.48 29.21,66.67 20.32,66.67 20.32,77.47 13.34,77.47 X2.2
SD_SCK
  Bottom 0.61: IC1.18 R7.1
SD_SCK3
  Bottom 0.61: R4.1 IC2.2 IC2.1 133.35,71.12 132.08,72.39 127.64,72.39 126.36,71.12 126.36,67.31 124.46,65.41 107.95,65.41 105.41,67.94 81.92,67.94 80.01,69.85 R7.2
SD_SCK3_B
  Bottom 0.61: IC2.3 140.97,73.66 142.24,74.93 142.24,88.9 140.97,90.17 SL5.5
SD_SDI
  Bottom 0.61: SL5.7 135.89,97.79 109.22,97.79 | IC1.23 48.9,83.82 45.72,87 45.72,96.52 47.62,98.42 108.58,98.42 109.22,97.79 | 109.22,97.79 R10.1
SD_SDO
  Bottom 0.61: R8.1 IC1.24
SD_SDO3  (via drill 0.7)
  Top 0.61: v71.12,90.81 v143.51,90.81
  Bottom 0.61: 144.78,71.12 IC2.4 R5.1 | R8.2 70.48,91.44 v71.12,90.81 | v143.51,90.81 144.78,89.53 144.78,71.12 | 144.78,71.12 IC2.5
SD_SDO3_B
  Bottom 0.61: SL5.2 148.59,82.55 149.86,81.28 149.86,74.93 148.59,73.66 IC2.6
USART_RX
  Bottom 0.61: IC16.12 43.81,78.74 46.35,76.2 IC1.26
USART_TX
  Bottom 0.61: IC16.11 44.45,76.2 45.72,74.93 53.34,74.93 53.34,78.74 IC1.25
VCC  (via drill 0.7, 0.7 pad 2.18)  (1 unrouted)
  Top 0.61: v99.69,50.8 v99.69,73.03 | v41.91,37.47 v95.25,37.47 | v40.64,56.52 v33.66,56.52 | v17.78,61.59 v17.78,81.92 | v124.46,33.02 v131.44,33.02 | v109.86,33.66 v109.86,5.71
  Bottom 0.61: C1.- 26.04,81.92 31.11,81.92 31.75,82.55 38.1,82.55 38.1,88.9 IC16.16 | T1.C LED2.A | IC24.10 137.16,45.72 137.16,43.18 | 137.16,43.18 137.16,40.64 IC24.12 | 139.7,43.18 139.7,39.37 140.97,38.1 IC24.2 144.78,38.1 145.41,37.47 145.41,33.02 135.89,33.02 | 139.7,43.18 137.16,43.18 | 41.91,56.52 v40.64,56.52 | 139.7,43.18 IC24.4 | 96.52,35.56 99.69,35.56 R1.1
  Bottom 0.813: 95.25,45.09 LED1.A
  Bottom 1.27: 81.28,87 SL4.4 | C12.1 41.91,93.34 IC16.16
  Bottom 1.422: T1.C 119.38,78.74 R2.2 101.6,88.9 99.69,87 | 99.69,87 81.28,87 | QG2.14 C11.1 v99.69,73.03 99.69,87 | 109.86,35.56 96.52,35.56 95.25,36.83 v95.25,37.47 | 109.86,35.56 IC19.14 113.03,33.02 119.38,33.02 | v99.69,50.8 99.69,48.26 95.89,44.45 | 41.91,53.98 v41.91,37.47 41.91,32.38 | 41.91,53.98 41.91,56.52 41.91,59.69 43.18,60.96 IC1.32 | v95.25,37.47 95.25,43.81 95.89,44.45 | 95.89,44.45 95.25,45.09 | IC4.20 31.75,29.21 41.91,29.21 | 43.18,29.21 IC31.1 | 43.18,29.21 48.26,29.21 IC31.20 | 41.91,29.21 43.18,29.21 | 41.91,29.21 41.91,32.38 | v33.66,56.52 IC3.20 24.13,61.59 v17.78,61.59 | 41.91,53.98 C6.1 | v95.25,37.47 SL6.3 | 41.91,32.38 C7.1 | v17.78,81.92 17.78,95.89 40.64,95.89 C12.1 | 119.38,33.02 C8.1 | v131.44,33.02 134.62,33.02 | 134.62,33.02 IC24.14 | 134.62,33.02 135.89,33.02 C10.1 | 119.38,33.02 v124.46,33.02 | 113.03,5.71 113.03,5.08 C9.1 | 113.03,5.71 IC29.14 | v109.86,5.71 113.03,5.71 | 109.86,35.56 v109.86,33.66
VCC3
  Bottom 0.61: SL5.4 143.51,96.52 139.7,96.52 139.7,90.81 | R10.2 125.73,93.98 T1.E
  Bottom 0.813: 139.7,90.81 135.89,87 IC2.14
  Bottom 1.422: 129.54,78.74 IC2.14 | 129.54,78.74 T1.E | C5.+ 129.54,78.74